# Altium schematic sheet LPCB235 - OPTONCDT - GROUP A.SchDoc
size A3; Address1: Factory 10; Address2: 9-13 Dingley Avenue, Dandeong, VICTORIA 3175, AUSTRALIA; DocumentNumber: 33; Revision: 1; SheetNumber: 33; SheetTotal: 37; Lockie__PCB_SUB_ASSEMBLY: OptoNCDT Group A; Lockie__PCB_ASSEMBLY: FCU PCB; Lockie__LDL: LPCB235; Lockie__PCB_DESCRIPTION: Flight Control Unit
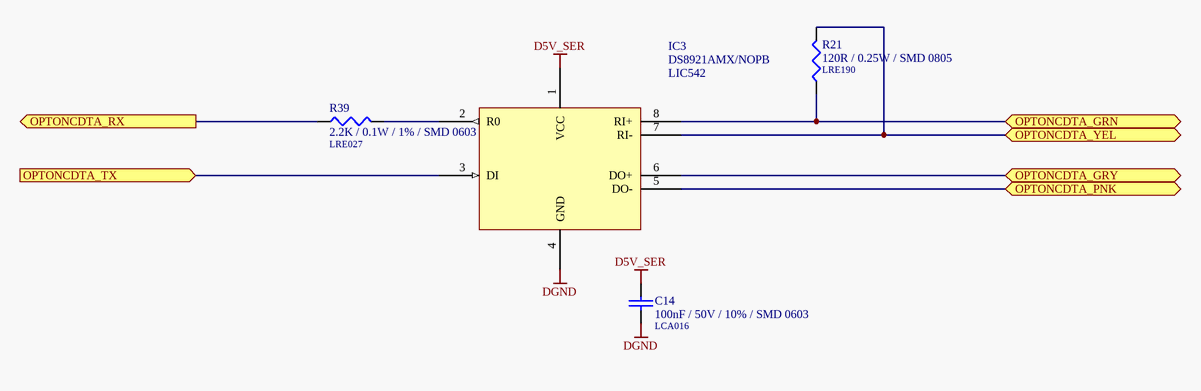
[diagram p0: LPCB235 - OPTONCDT - GROUP A.SchDoc]

## Parts
C14  100nF / 50V / 10% / SMD 0603  LDL_NUMBER: LCA016  [LFP011__CC1608-0603-IPC7351_B]
IC3  DS8921AMX/NOPB  LDL_NUMBER: LIC542  [LFP069__R-8G]
R21  120R / 0.25W / SMD 0805  LDL_NUMBER: LRE190  [LFP029__CR2012-0805]
R39  2.2K / 0.1W / 1% / SMD 0603  LDL_NUMBER: LRE027  [LFP020__CR1608-0603-IPC7351_B]

## Ports
OPTONCDTA_GRN (bidir), OPTONCDTA_GRY (bidir), OPTONCDTA_PNK (bidir), OPTONCDTA_RX (out), OPTONCDTA_TX (in), OPTONCDTA_YEL (bidir)

## Nets
D5V_SER: C14.1 IC3.1(VCC)
DGND: C14.2 IC3.4(GND)
OPTONCDTA_GRN: IC3.8(RI+) R21.1 ; port OPTONCDTA_GRN
OPTONCDTA_GRY: IC3.6(DO+) ; port OPTONCDTA_GRY
OPTONCDTA_PNK: IC3.5(DO-) ; port OPTONCDTA_PNK
OPTONCDTA_RX: R39.1 ; port OPTONCDTA_RX
OPTONCDTA_TX: IC3.3(DI) ; port OPTONCDTA_TX
OPTONCDTA_YEL: IC3.7(RI-) R21.2 ; port OPTONCDTA_YEL
NetIC3_2: IC3.2(R0) R39.2

## Notes on the sheet
- PCB COMPONENT DESCRIPTION
- LDL NUMBER
- Assembly Details
- Size
- Drawing File Name
- Revision
- http://rloop.org
- Scale
- A3
- Sheet Details
- N.T.S
- Sheet:
- Of:

## Library data of the parts
C14 = 100nF / 50V / 10% / SMD 0603: Capacitor, Ceramic Chip, 100nF (0.1uF), 50V, 5%, SMD 0603 [LCA016]; Value: 100n; FMEDA__OPERATING__VOLTAGE_MIN: 0; FMEDA__OPERATING__VOLTAGE_MAX: 3.3; FMEDA__OPERATING__TEMP_MIN: -20; FMEDA__OPERATING__TEMP_TYP: 27; FMEDA__OPERATING__TEMP_MAX: 50; FMEDA__CHANNEL: COM; FMEDA__FUNCTION_IN_SYSTEM: *; FMEDA__OPERATING__VOLTAGE_TYP: 3.3
IC3 = DS8921AMX/NOPB: IC, RS422 Tx Rx, SMD SOIC 8
R21 = 120R / 0.25W / SMD 0805: Resistor, Thick Film, 120R, 0.25W, 5%, SMD 0805 [LRE190]; Value: 120; FMEDA__OPERATING__POWER_MAX: 0; FMEDA__OPERATING__TEMP_MAX: 155; FMEDA__OPERATING__TEMP_MIN: -55; FMEDA__OPERATING__TEMP_TYP: 27; FMEDA__OPERATING__VOLTAGE_TYP: 150; FMEDA__CHANNEL: COM; FMEDA__OPERATING__POWER_MIN: 0; FMEDA__OPERATING__VOLTAGE_MAX: 0; FMEDA__OPERATING__VOLTAGE_MIN: 0; FMEDA__FUNCTION_IN_SYSTEM: *
R39 = 2.2K / 0.1W / 1% / SMD 0603: Resistor, Ceramic Chip, 2.2K, 0.1W, 1%, SMD 0603 [LRE027]; FMEDA__OPERATING__VOLTAGE_MIN: 0; FMEDA__OPERATING__TEMP_MIN: -20; FMEDA__OPERATING__TEMP_TYP: 27; FMEDA__OPERATING__TEMP_MAX: 50; FMEDA__CHANNEL: COM; VALUE: 2.2K; FMEDA__OPERATING__VOLTAGE_MAX: 0; FMEDA__OPERATING__POWER_MIN: 0; FMEDA__OPERATING__POWER_MAX: 0; FMEDA__FUNCTION_IN_SYSTEM: *; FMEDA__OPERATING__VOLTAGE_TYP: 0